# Altium schematic sheet ETH.SchDoc
size A; SheetNumber: 5; SheetTotal: 7
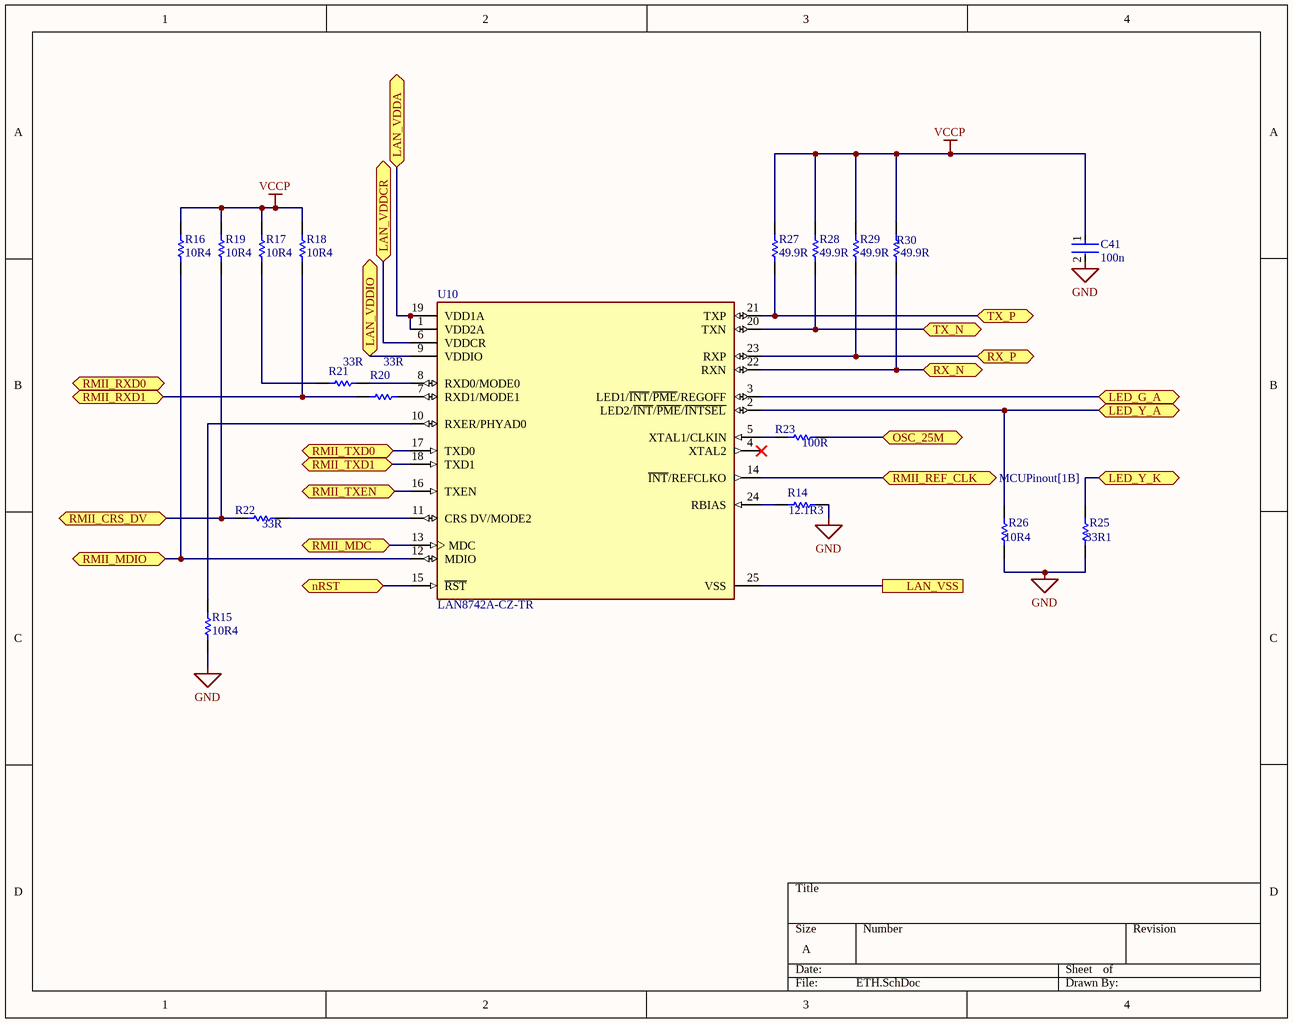
[diagram p0: ETH.SchDoc]

## Parts
C41  100n  [FP-GRM033-0_03-MFG]
R14  12.1R3  [RESC1608X55X30LL20T20]
R15  10R4  [RESC1608X55X30LL20T20]
R16  10R4  [RESC1608X55X30LL20T20]
R17  10R4  [RESC1608X55X30LL20T20]
R18  10R4  [RESC1608X55X30LL20T20]
R19  10R4  [RESC1608X55X30LL20T20]
R20  33R  [RESC1608X55X30LL20T20]
R21  33R  [RESC1608X55X30LL20T20]
R22  33R  [RESC1608X55X30LL20T20]
R23  100R  [RESC1608X55X30LL20T20]
R25  33R1  [RESC1608X55X30LL20T20]
R26  10R4  [RESC1608X55X30LL20T20]
R27  49.9R  [RESC1608X55X30LL20T20]
R28  49.9R  [RESC1608X55X30LL20T20]
R29  49.9R  [RESC1608X55X30LL20T20]
R30  49.9R  [RESC1608X55X30LL20T20]
U10  LAN8742A-CZ-TR  [FP-C04-143B-S4QFN-MFG]

## Ports
LAN_VDDA (bidir, see 3.3V[3C]), LAN_VDDCR (bidir, see 3.3V[4C]), LAN_VDDIO (bidir, see 3.3V[3C]), LAN_VSS (see 3.3V[4C]), LED_G_A (bidir, see RJ45[3C]), LED_Y_A (bidir, see RJ45[3C]), LED_Y_K (bidir, see RJ45[3C]), nRST (bidir, see MCUPinout[1B], Random[2A], Random[2C]), OSC_25M (bidir, see ADC[2C]), RMII_CRS_DV (bidir, see MCUPinout[1C]), RMII_MDC (bidir, see MCUPinout[1B]), RMII_MDIO (bidir, see MCUPinout[1B]), RMII_REF_CLK (bidir, see MCUPinout[1B]), RMII_RXD0 (bidir, see MCUPinout[1C]), RMII_RXD1 (bidir, see MCUPinout[1C]), RMII_TXD0 (bidir, see MCUPinout[4C]), RMII_TXD1 (bidir, see MCUPinout[4A]), RMII_TXEN (bidir, see MCUPinout[4C]), RX_N (bidir, see RJ45[1C]), RX_P (bidir, see RJ45[1C]), TX_N (bidir, see RJ45[1B]), TX_P (bidir, see RJ45[1B])

## Nets
GND: C41.2 R14.2 R15.1 R25.1 R26.1
VCCP: C41.1 R16.2 R17.2 R18.2 R19.2 R27.2 R28.2 R29.2 R30.2
LAN_VDDA: U10.1(VDD2A) U10.19(VDD1A) ; port LAN_VDDA
LAN_VDDCR: U10.6(VDDCR) ; port LAN_VDDCR
LAN_VDDIO: U10.9(VDDIO) ; port LAN_VDDIO
LAN_VSS: U10.25(VSS) ; port LAN_VSS
LED_G_A: U10.3(LED1/~{INT}/~{PME}/REGOFF) ; port LED_G_A
LED_Y_A: R26.2 U10.2(LED2/~{INT}/~{PME}/~{INTSEL}) ; port LED_Y_A
LED_Y_K: R25.2 ; port LED_Y_K
nRST: U10.15(~{RST}) ; port nRST
OSC_25M: R23.2 ; port OSC_25M
RMII_CRS_DV: R19.1 R22.1 ; port RMII_CRS_DV
RMII_MDC: U10.13(MDC) ; port RMII_MDC
RMII_MDIO: R16.1 U10.12(MDIO) ; port RMII_MDIO
RMII_REF_CLK: U10.14(~{INT}/REFCLKO) ; port RMII_REF_CLK
RMII_RXD1: R18.1 R20.1 ; port RMII_RXD1
RMII_TXD0: U10.17(TXD0) ; port RMII_TXD0
RMII_TXD1: U10.18(TXD1) ; port RMII_TXD1
RMII_TXEN: U10.16(TXEN) ; port RMII_TXEN
RX_N: R30.1 U10.22(RXN) ; port RX_N
RX_P: R29.1 U10.23(RXP) ; port RX_P
TX_N: R28.1 U10.20(TXN) ; port TX_N
TX_P: R27.1 U10.21(TXP) ; port TX_P
NetR14_1: R14.1 U10.24(RBIAS)
NetR15_2: R15.2 U10.10(RXER/PHYAD0)
NetR17_1: R17.1 R21.1
NetR20_2: R20.2 U10.7(RXD1/MODE1)
NetR21_2: R21.2 U10.8(RXD0/MODE0)
NetR22_2: R22.2 U10.11(CRS_DV/MODE2)
NetR23_1: R23.1 U10.5(XTAL1/CLKIN)

Not connected (* = marked no-connect by the designer): U10 4(XTAL2)*

## Library data of the parts
C41 = CMP-06035-000062-2: Chip Multilayer Ceramic Capacitors for General Purpose, 0201, 0.10uF, X5R, 15%, 10%, 6.3V; Capacitance: 100nF; Min Operating Temperature: -55°C; Lead Free: Lead Free; Radiation Hardening: No; Dielectric: X5R; Voltage Rating (DC): 6.3V; REACH SVHC: No SVHC; Case/Package: 0201; Voltage Rating: 6.3V; Length: 0.6mm; Max Operating Temperature: 85°C; Width: 0.012inch; Depth: 0.3mm; Material: Ceramic; Case Code (Metric): 0603; Thickness: 0.013inch; Packaging: Tape and Reel; Height: 0.3mm; Weight: 6E-06oz; Package Quantity: 1; Mount: Surface Mount; Voltage: 6.3V; Case Code (Imperial): 0201; Tolerance: 10%; Termination: SMD/SMT
R14-R23 R25-R30 = CMP-2000-00025-1: Part Number: ERA3AEB301V; Manufacturer: Panasonic
U10 = CMP-06281-000006-2: IC TRANSCEIVER 1/1 24SQFN; Manufacturer: Microchip; Nominal Supply Current: 6.5-59mA; Max Supply Voltage: 3.6V; Number Of Channels: 1; Data Rate: 100Mbits/s; Interface: Ethernet,Other; Min Supply Voltage: 1.14V; Standoff Height: 0mm; Simplex Duplex: Full-Duplex; Height: 1mm; Ambient Temperature Range High: +70°C; Category: IC; Mouser Description: Small Footprint RMII 10/100 Ethernet Transceiver with flexPWR Technology; Manufacturer Part Number: LAN8742A-CZ-TR; Digikey Description: IC TRANSCEIVER 1/1 24SQFN; Octopart: https://octopart.com/lan8742a-cz-tr-microchip-29030587; Temperature: 0°C to +70°C; Ambient Temperature Range Low: 0°C; Temperature Range Low: 0°C; ComponentLink2Description: Datasheet; Automotive: No; RoHS: TRUE; Device Class L3: Ethernet Interface ICs; Device Class L1: Integrated Circuits (ICs); Device Class L2: Interface ICs; Lead Free: Yes; Ipc Land Pattern Name: QFN50P400X400X90-24; ComponentLink2URL: http://ww1.microchip.com/downloads/en/DeviceDoc/DS_LAN8742_00001989A.pdf; Temperature Range High: +70°C; Package: C04-143B-S4QFN